# EAGLE schematic backup (EAGLE 7.6.0)
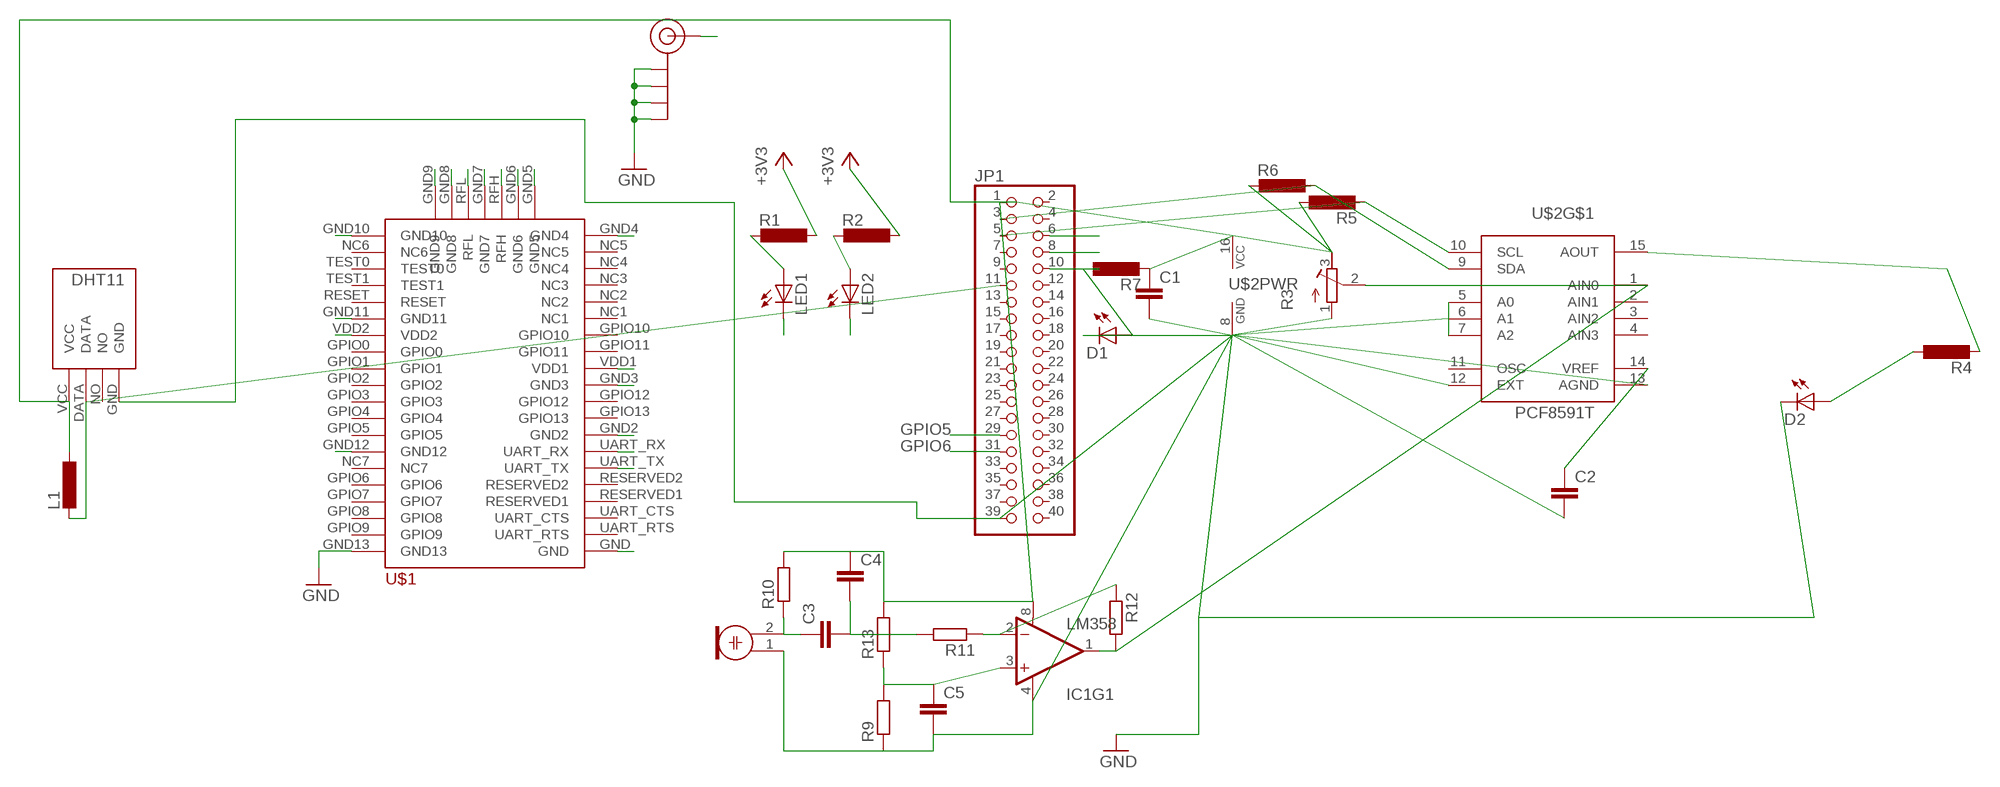
[diagram p0: schematic, sheet 1]

## Parts
C1  C-EU025-024X044  [C025-024X044]
C2  C-EU025-024X044  [C025-024X044]
C3  C-EU025-024X044  [C025-024X044]
C4  C-EU025-024X044  [C025-024X044]
C5  C-EU025-024X044  [C025-024X044]
D1  LED5MM  [LED5MM]
D2  LED5MM  [LED5MM]
IC1  LM358  [DIP08]
J$1  SMA_EDGE  [SMA-EDGE]
JP1  PINHD-2X20  [2X20]
L1  L-EU0204/7  [0204/7]
LED1  LED5MM  [LED5MM]
LED2  LED5MM  [LED5MM]
M1  ELECTRET_MICROPHON-F6050AP  [F6050AP]
R1  L-EU0204/7  [0204/7]
R2  L-EU0204/7  [0204/7]
R3  R-TRIMM4G/J  [RTRIM4G/J]
R4  L-EU0204/7  [0204/7]
R5  L-EU0204/7  [0204/7]
R6  L-EU0204/7  [0204/7]
R7  L-EU0204/7  [0204/7]
R9  R-EU_0204/7  [0204/7]
R10  R-EU_0204/7  [0204/7]
R11  R-EU_0204/7  [0204/7]
R12  R-EU_0204/7  [0204/7]
R13  R-EU_0204/7  [0204/7]
U$1  RN2483  [RN2483]
U$2  PCF8591T  [SO16]
U$3  DHT11-PION.  [DHT11-PION.]

## Nets
+3V3: C1.1 C4.1 IC1.8(V+) JP1.1 L1.1 R1.1 R2.1 R3.3(E) R5.1 R6.2 R7.2 R10.2 R13.2 U$1.VDD1 U$1.VDD2 U$2.16(PWR:VCC) U$3.VCC
GND: C1.2 C2.2 C5.2 D1.K(C) D2.K(C) IC1.4(V-) J$1.GND@0(GND) J$1.GND@1(GND) J$1.GND@2(GND) J$1.GND@3(GND) JP1.6 JP1.39 M1.1 R3.1(A) R9.1 U$1.GND U$1.GND2 U$1.GND3 U$1.GND4 U$1.GND10 U$1.GND11 U$1.GND12 U$1.GND13 U$2.5(A0) U$2.6(A1) U$2.7(A2) U$2.8(PWR:GND) U$2.12(EXT) U$2.13(AGND) U$3.GND
GPIO5: JP1.29 LED1.K(C)
GPIO6: JP1.31 LED2.K(C)
N$1: LED1.A R1.2
N$2: LED2.A R2.2
N$3: U$1.GND5
N$4: U$1.GND6
N$6: U$1.GND7
N$7: U$1.RFL
N$8: U$1.GND8
N$9: U$1.GND9
N$10: JP1.11 L1.2 U$3.DATA
N$12: IC1.2(-IN) R11.1 R12.1
N$15: JP1.3 R6.1 U$2.9(SDA)
N$16: JP1.5 R5.2 U$2.10(SCL)
N$17: D1.A R7.1
N$18: C2.1 U$2.14(VREF)
N$19: R4.2 U$2.15(AOUT)
N$20: D2.A R4.1
N$21: IC1.1(OUT) R3.2(S) R12.2 U$2.1(AIN0)
N$22: C3.1 M1.2 R10.1
N$23: C3.2 C4.2 R11.2
N$24: C5.1 IC1.3(+IN) R9.2 R13.1
RFH: J$1.SIG(SIGNAL) U$1.RFH
UART_RX: JP1.8 U$1.UART_RX
UART_TX: JP1.10 U$1.UART_TX
Unconnected: IC1.5(+IN) IC1.6(-IN) IC1.7(OUT) JP1.2 JP1.4 JP1.7 JP1.9 JP1.12 JP1.13 JP1.14 JP1.15 JP1.16 JP1.17 JP1.18 JP1.19 JP1.20 JP1.21 JP1.22 JP1.23 JP1.24 JP1.25 JP1.26 JP1.27 JP1.28 JP1.30 JP1.32 JP1.33 JP1.34 JP1.35 JP1.36 JP1.37 JP1.38 JP1.40 U$1.GPIO0 U$1.GPIO1 U$1.GPIO2 U$1.GPIO3 U$1.GPIO4 U$1.GPIO5 U$1.GPIO6 U$1.GPIO7 U$1.GPIO8 U$1.GPIO9 U$1.GPIO10 U$1.GPIO11 U$1.GPIO12 U$1.GPIO13 U$1.NC1 U$1.NC2 U$1.NC3 U$1.NC4 U$1.NC5 U$1.NC6 U$1.NC7 U$1.RESERVED1 U$1.RESERVED2 U$1.RESET U$1.TEST0 U$1.TEST1 U$1.UART_CTS U$1.UART_RTS U$2.2(AIN1) U$2.3(AIN2) U$2.4(AIN3) U$2.11(OSC) U$3.NO

## Library data of the parts
C1-C5 = resistor:C-EU: CAPACITOR, European symbol
D1 D2 LED1 LED2 = adafruit:LED: LED OSRAM: - CHIPLED LG R971, LG N971, LY N971, LG Q971, LY Q971, LO R971, LY R971 LH N974, LH R974 LS Q976, LO Q976, LY Q976 LO Q996 - Hyper CHIPLED LW Q18S LB Q993, LB Q99A, LB R99A - SideLED LS A670, LO A670, LY A670, LG A670, LP A670 LB A673, LV A673, LT A673, LW A673 LH A674 LY A675 LS A676, LA A676, LO A676, LY A676, LW A676 LS A679, LY A679, LG A679 - Hyper Micro SIDELED® LS Y876, LA Y876, LO Y876, LY Y876 LT Y87S - SmartLED LW L88C, LW L88S LB L89C, LB L89S, LG L890 LS L89K, LO L89K, LY L89K LS L896, LA L896, LO L896, LY L896 - TOPLED LS T670, LO T670, LY T670, LG T670, LP T670 LSG T670, LSP T670, LSY T670, LOP T670, LYG T670 LG T671, LOG T671, LSG T671 LB T673, LV T673, LT T673, LW T673 LH T674 LS T676, LA T676, LO T676, LY T676, LB T676, LH T676, LSB T676, LW T676 LB T67C, LV T67C, LT T67C, LS T67K, LO T67K, LY T67K, LW E67C LS E67B, LA E67B, LO E67B, LY E67B, LB E67C, LV E67C, LT E67C LW T67C LS T679, LY T679, LG T679 LS T770, LO T770, LY T770, LG T770, LP T770 LB T773, LV T773, LT T773, LW T773 LH T774 LS E675, LA E675, LY E675, LS T675 LS T776, LA T776, LO T776, LY T776, LB T776 LHGB T686 LT T68C, LB T68C - Hyper Mini TOPLED® LB M676 - Mini TOPLED Santana® LG M470 LS M47K, LO M47K, LY M47K Source: http://www.osram.convergy.de/
IC1 = SparkFun-AnalogIC:LM358: Jellybean op-amp; PROD_ID: IC-09172
J$1 = SparkFun-Connectors:SMA_EDGE: SMA Antenna Connector End launch SMA connector. The paste layer has been removed so that the connector can be hand soldered onto the board after reflow.
JP1 = adafruit:PINHD-2X20: PIN HEADER
L1 R1 R2 R4-R7 = resistor:L-EU: INDUCTOR, European symbol
M1 = microphon:ELECTRET_MICROPHON-: Electret Condenser Microphone
R3 = resistor:R-TRIMM: Trimm resistor
R9-R13 = resistor:R-EU_: RESISTOR, European symbol
U$1 = RN2483:RN2483: Microchip RN2483 LoRaWAN Module
U$2 = i2c:PCF8591: 8-Bit A/D and D/A Converter
U$3 = DHT11:DHT11-PION.: DHT11 Czujnik temperatury i wilgotności (widok pionowy)

## Module HDT11
Ports: 

### Library data of the parts